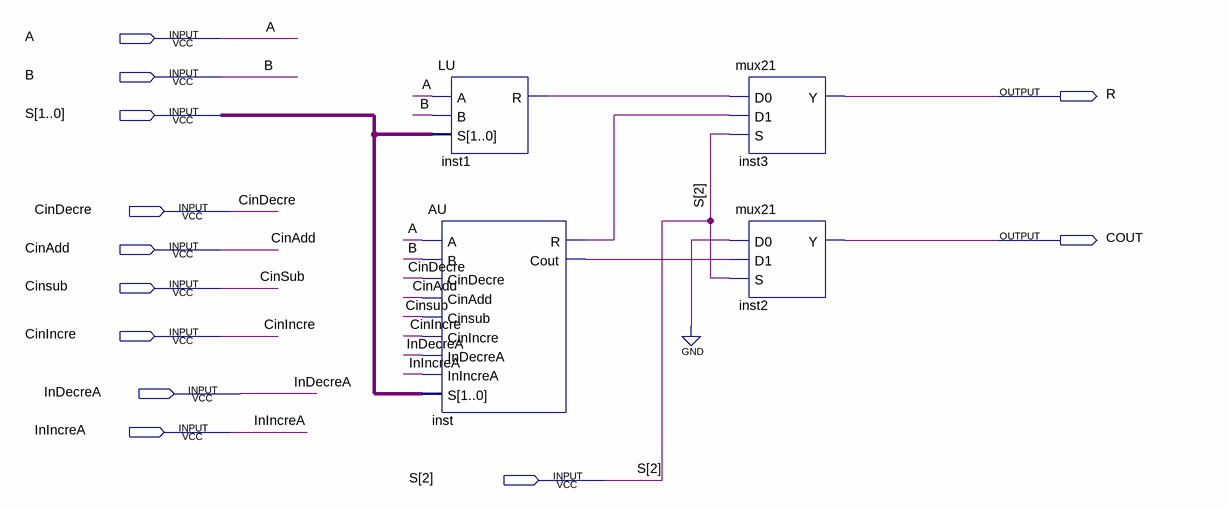
[diagram p0: schematic sheet]
// Quartus schematic alu1bit.bdf as structural Verilog: 4 symbols, 12 pins
module alu1bit (
  input  A,
  input  B,
  input  [2:0] S,
  input  CinDecre,
  input  CinAdd,
  input  Cinsub,
  input  CinIncre,
  input  InDecreA,
  input  InIncreA,
  output R,
  output COUT
);

  wire inst1_r, inst_cout, inst_r;

  LU inst1 (.A(A), .B(B), .S(S[1:0]), .R(inst1_r));
  AU inst (
    .A(A), .B(B), .CinDecre(CinDecre), .CinAdd(CinAdd), .Cinsub(Cinsub), .CinIncre(CinIncre),
    .InDecreA(InDecreA), .InIncreA(InIncreA), .S(S[1:0]), .R(inst_r), .Cout(inst_cout));
  mux21 inst3 (.D0(inst1_r), .D1(inst_r), .S(S[2]), .Y(R));
  mux21 inst2 (.D0(1'b0), .D1(inst_cout), .S(S[2]), .Y(COUT));
endmodule
